# Altium schematic sheet US_EPS_MCU.SchDoc
size A3
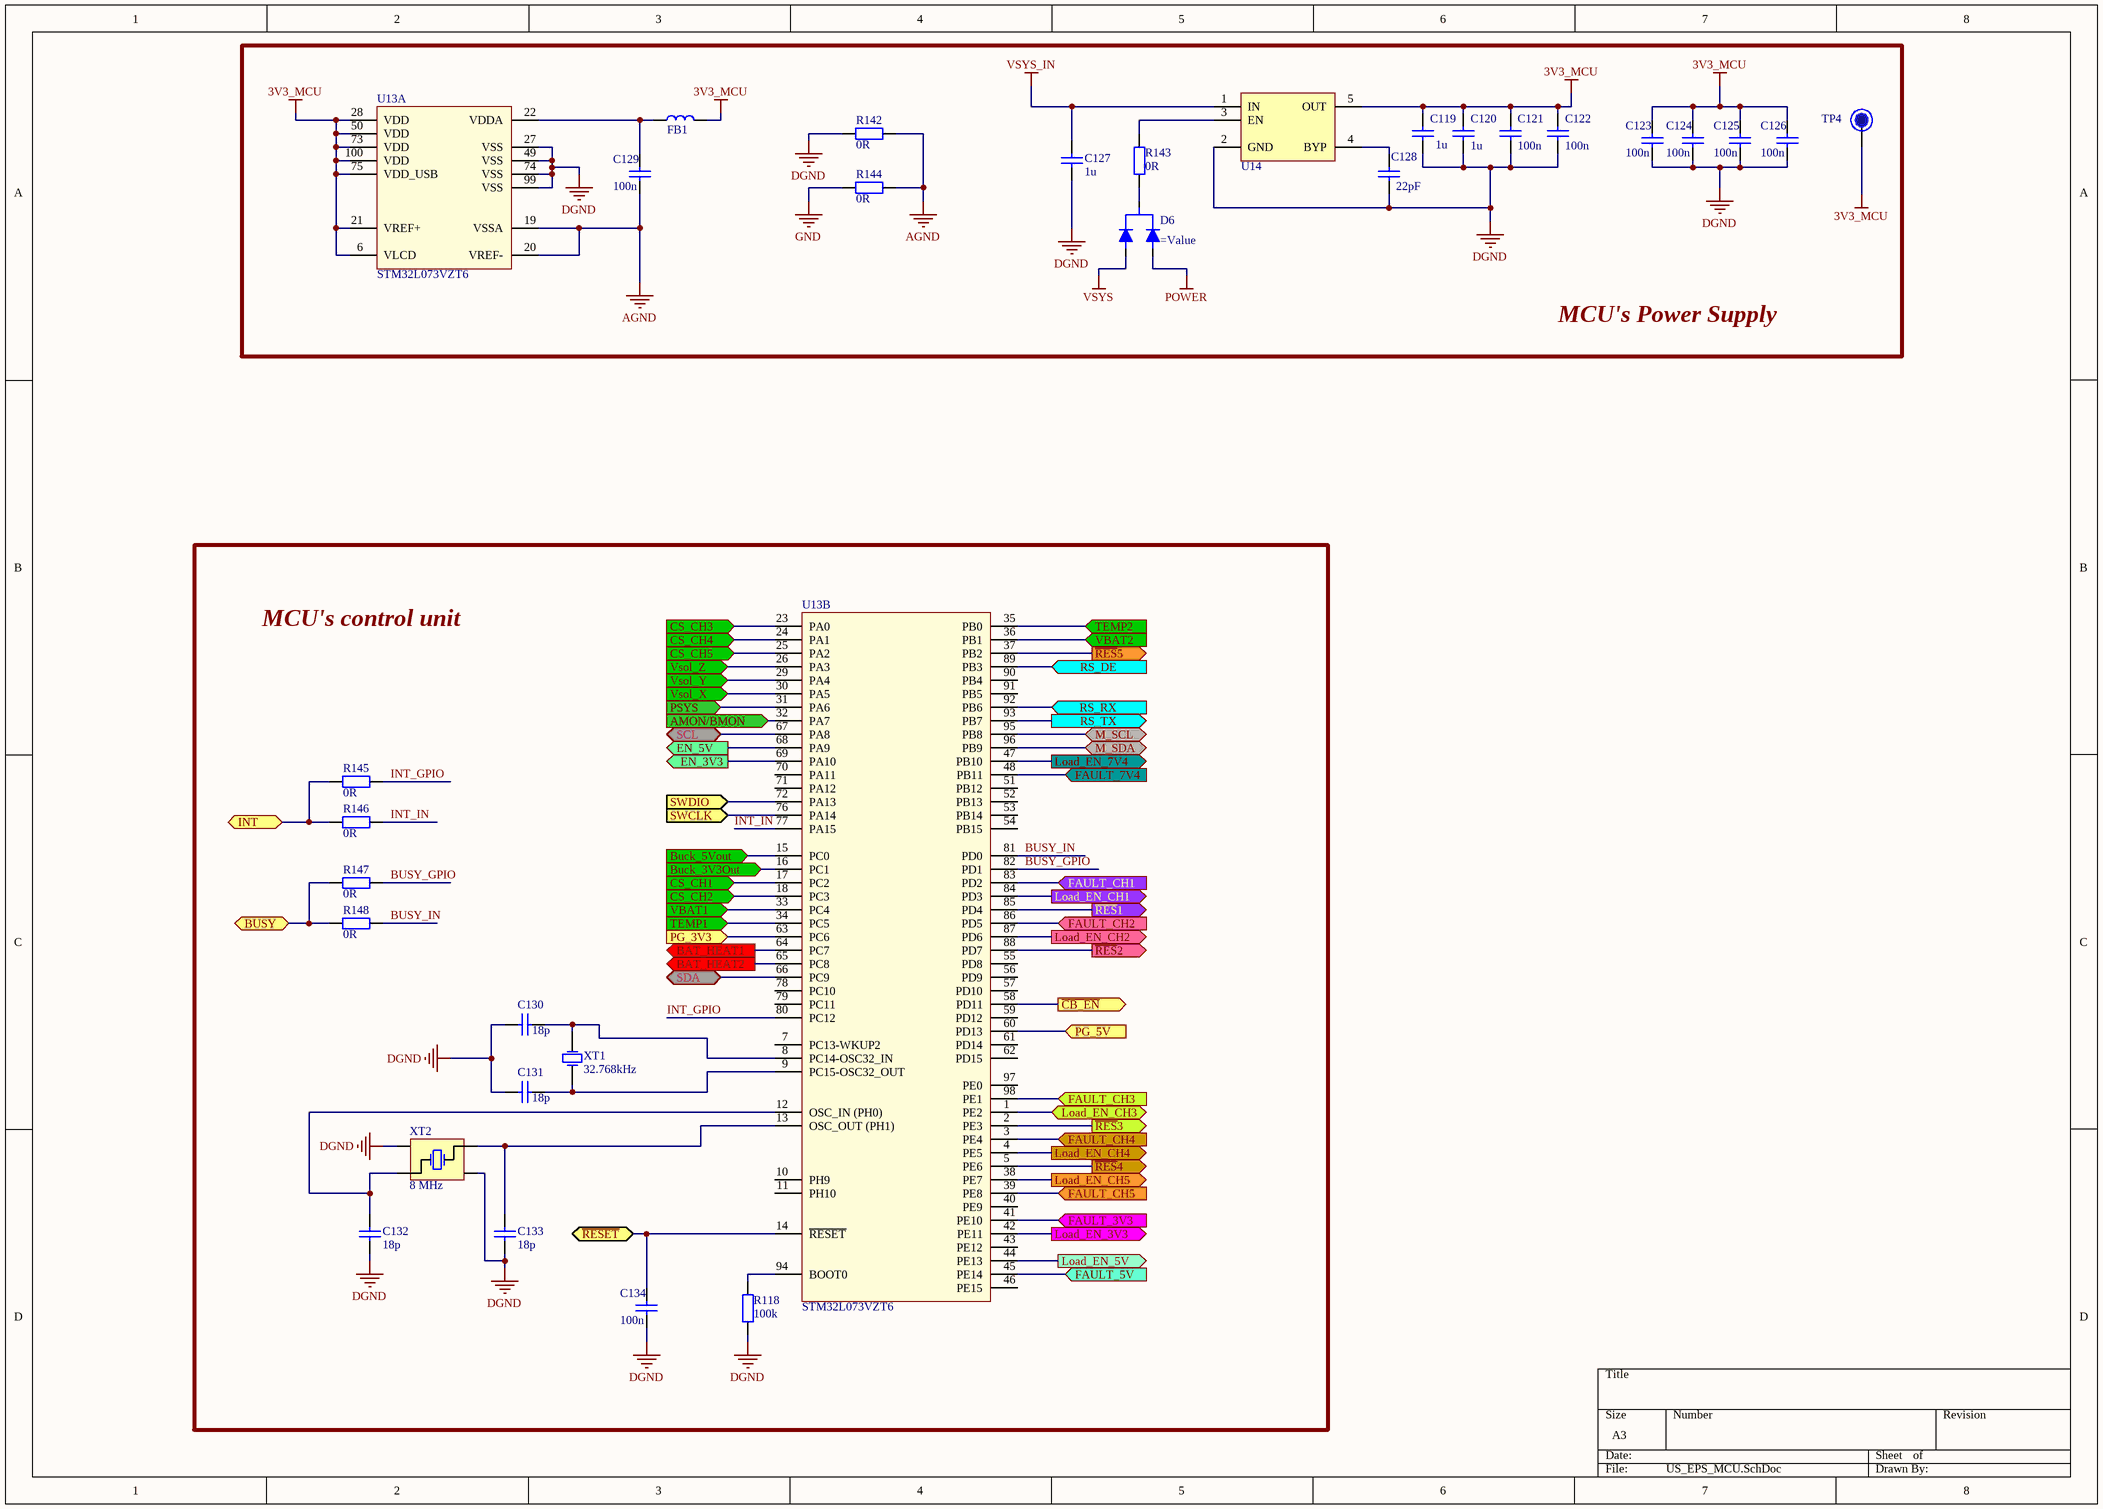
[diagram p0: US_EPS_MCU.SchDoc]

## Parts
C119  1u  [C0603_IPC_HD]
C120  1u  [C0603_IPC_HD]
C121  100n  [C0603_IPC_HD]
C122  100n  [C0603_IPC_HD]
C123  100n  [C0603_IPC_HD]
C124  100n  [C0603_IPC_HD]
C125  100n  [C0603_IPC_HD]
C126  100n  [C0603_IPC_HD]
C127  1u  [C0603_IPC_HD]
C128  22pF  [C0603_IPC_HD]
C129  100n  [C0603_IPC_HD]
C130  18p  [C0603_IPC_HD]
C131  18p  [C0603_IPC_HD]
C132  18p  [C0603_IPC_HD]
C133  18p  [C0603_IPC_HD]
C134  100n  [C0603_IPC_HD]
D6  (no value)  [BAT54C_SOT23]
FB1  MH1608-601Y  [L0603_IPC_MD]  (value not drawn)
R118  100k  [R0603_IPC_MD]
R142  0R  [R0603_IPC_MD]
R143  0R  [R0603_IPC_MD]
R144  0R  [R0603_IPC_MD]
R145  0R  [R0603_IPC_MD]  (no BOM)
R146  0R  [R0603_IPC_MD]  (no BOM)
R147  0R  [R0603_IPC_MD]  (no BOM)
R148  0R  [R0603_IPC_MD]  (no BOM)
TP4  Test Point  [TestPoint_1M5]  (value not drawn)  (no BOM)
U13  STM32L073VZT6  [STM32L073_TSQFP50P1600X1600X160-100N]  (parts A,B of 2)
U14  MIC5216-3.3YM5-TR  [SOT23-5_(MT)]  (value not drawn)
XT1  32.768kHz  [FC-135R]
XT2  8 MHz  [5.0X3.2_4PAD_SMT]

## Blocks framed on the sheet
MCU's Power Supply: C119-C129 D6 FB1 R142-R144 TP4 U13 U14
MCU's control unit: C130-C134 R118 R145-R148 U13 XT1 XT2

## Ports
AMON/BMON (in), BAT_HEAT1 (out), BAT_HEAT2 (out), Buck_3V3Out (in), Buck_5Vout (in), BUSY, CS_CH1 (in), CS_CH2 (in), CS_CH3 (in), CS_CH4 (in), CS_CH5 (in), EN_3V3 (out), EN_5V (out), FAULT_3V3 (in), FAULT_5V (in), FAULT_7V4 (in), FAULT_CH1 (in), FAULT_CH2 (in), FAULT_CH3 (in), FAULT_CH4 (in), FAULT_CH5 (in), INT, Load_EN_3V3 (out), Load_EN_5V (out), Load_EN_7V4 (out), Load_EN_CH1 (out), Load_EN_CH2 (out), Load_EN_CH3, Load_EN_CH4 (out), Load_EN_CH5 (out), M_SCL, M_SDA, PG_3V3 (in), PG_5V (in), PSYS (in), RS_DE (in), RS_RX (in), RS_TX (out), SCL, SDA, SWCLK (in), SWDIO (in), TEMP1 (in), TEMP2 (in), VBAT1 (in), VBAT2 (in), Vsol_X (in), Vsol_Y (in), Vsol_Z (in), ~{CB_EN} (out), ~{RESET}, ~{RES}1 (out), ~{RES}2 (out), ~{RES}3 (out), ~{RES}4 (out), ~{RES}5 (out)

## Nets
3V3_MCU: C119.2 C120.2 C121.2 C122.2 C123.2 C124.2 C125.2 C126.2 FB1.2 TP4.0 U13.6(VLCD) U13.21(VREF+) U13.28(VDD) U13.50(VDD) U13.73(VDD) U13.75(VDD_USB) U13.100(VDD) U14.5(OUT)
AGND: C129.1 R142.1 R144.1 U13.19(VSSA) U13.20(VREF-)
DGND: C119.1 C120.1 C121.1 C122.1 C123.1 C124.1 C125.1 C126.1 C127.1 C128.1 C130.1 C131.1 C132.1 C133.1 C134.1 R118.1 R142.2 U13.27(VSS) U13.49(VSS) U13.74(VSS) U13.99(VSS) U14.2(GND) XT2.2(NC) XT2.4(NC)
GND: R144.2
POWER: D6.2
VSYS: D6.1
VSYS_IN: C127.2 U14.1(IN)
~{CB_EN}: U13.58(PD11) ; port ~{CB_EN}
~{RES}1: U13.85(PD4) ; port ~{RES}1
~{RES}2: U13.88(PD7) ; port ~{RES}2
~{RES}3: U13.2(PE3) ; port ~{RES}3
~{RES}4: U13.5(PE6) ; port ~{RES}4
~{RES}5: U13.37(PB2) ; port ~{RES}5
AMON/BMON: U13.32(PA7) ; port AMON/BMON
BAT_HEAT1: U13.64(PC7) ; port BAT_HEAT1
BAT_HEAT2: U13.65(PC8) ; port BAT_HEAT2
Buck_3V3Out: U13.16(PC1) ; port Buck_3V3Out
Buck_5Vout: U13.15(PC0) ; port Buck_5Vout
BUSY: R147.2 R148.2 ; port BUSY
BUSY_GPIO: R147.1 U13.82(PD1)
BUSY_IN: R148.1 U13.81(PD0)
CS_CH1: U13.17(PC2) ; port CS_CH1
CS_CH2: U13.18(PC3) ; port CS_CH2
CS_CH3: U13.23(PA0) ; port CS_CH3
CS_CH4: U13.24(PA1) ; port CS_CH4
CS_CH5: U13.25(PA2) ; port CS_CH5
EN_3V3: U13.69(PA10) ; port EN_3V3
EN_5V: U13.68(PA9) ; port EN_5V
FAULT_3V3: U13.41(PE10) ; port FAULT_3V3
FAULT_5V: U13.45(PE14) ; port FAULT_5V
FAULT_7V4: U13.48(PB11) ; port FAULT_7V4
FAULT_CH1: U13.83(PD2) ; port FAULT_CH1
FAULT_CH2: U13.86(PD5) ; port FAULT_CH2
FAULT_CH3: U13.98(PE1) ; port FAULT_CH3
FAULT_CH4: U13.3(PE4) ; port FAULT_CH4
FAULT_CH5: U13.39(PE8) ; port FAULT_CH5
INT: R145.2 R146.2 ; port INT
INT_GPIO: R145.1 U13.80(PC12)
INT_IN: R146.1 U13.77(PA15)
Load_EN_3V3: U13.42(PE11) ; port Load_EN_3V3
Load_EN_5V: U13.44(PE13) ; port Load_EN_5V
Load_EN_7V4: U13.47(PB10) ; port Load_EN_7V4
Load_EN_CH1: U13.84(PD3) ; port Load_EN_CH1
Load_EN_CH2: U13.87(PD6) ; port Load_EN_CH2
Load_EN_CH3: U13.1(PE2) ; port Load_EN_CH3
Load_EN_CH4: U13.4(PE5) ; port Load_EN_CH4
Load_EN_CH5: U13.38(PE7) ; port Load_EN_CH5
M_SCL: U13.95(PB8) ; port M_SCL
M_SDA: U13.96(PB9) ; port M_SDA
PG_3V3: U13.63(PC6) ; port PG_3V3
PG_5V: U13.60(PD13) ; port PG_5V
PSYS: U13.31(PA6) ; port PSYS
~{RESET}: C134.2 U13.14(~{RESET}) ; port ~{RESET}
RS_DE: U13.89(PB3) ; port RS_DE
RS_RX: U13.92(PB6) ; port RS_RX
RS_TX: U13.93(PB7) ; port RS_TX
SCL: U13.67(PA8) ; port SCL
SDA: U13.66(PC9) ; port SDA
SWCLK: U13.76(PA14) ; port SWCLK
SWDIO: U13.72(PA13) ; port SWDIO
TEMP1: U13.34(PC5) ; port TEMP1
TEMP2: U13.35(PB0) ; port TEMP2
VBAT1: U13.33(PC4) ; port VBAT1
VBAT2: U13.36(PB1) ; port VBAT2
Vsol_X: U13.30(PA5) ; port Vsol_X
Vsol_Y: U13.29(PA4) ; port Vsol_Y
Vsol_Z: U13.26(PA3) ; port Vsol_Z
NetC128_2: C128.2 U14.4(BYP)
NetC129_2: C129.2 FB1.1 U13.22(VDDA)
NetC130_2: C130.2 U13.8(PC14-OSC32_IN) XT1.2(OSC2)
NetC131_2: C131.2 U13.9(PC15-OSC32_OUT) XT1.1(OSC1)
NetC132_2: C132.2 U13.12(OSC_IN_(PH0)) XT2.3(OSC2)
NetC133_2: C133.2 U13.13(OSC_OUT_(PH1)) XT2.1(OSC1)
NetD6_3: D6.3 R143.1
NetR118_2: R118.2 U13.94(BOOT0)
NetR143_2: R143.2 U14.3(EN)

Not connected (* = marked no-connect by the designer): U13 7(PC13-WKUP2) 10(PH9) 11(PH10) 40(PE9) 43(PE12) 46(PE15) 51(PB12) 52(PB13) 53(PB14) 54(PB15) 55(PD8) 56(PD9) 57(PD10) 59(PD12) 61(PD14) 62(PD15) 70(PA11) 71(PA12) 78(PC10) 79(PC11) 90(PB4) 91(PB5) 97(PE0)

## Library data of the parts
C119 C120 C127 = CL10B105MO8NNWC: CAP CER 1UF 16V X7R 0603; Manufacturer: Samsung Electro-Mechanics; Manufacturer Part Number: CL10B105MO8NNWC; Voltage: 16V; Value: 1u; Dielectric: X7R; Supplier 1: Digi-Key; Supplier Part Number 1: 1276-6524-1-ND
C121-C126 C129 C134 = CL10B104KO8NNNC: CAP CER 0.1UF 16V X7R 0603; Manufacturer: Samsung Electro-Mechanics; Manufacturer Part Number: CL10B104KO8NNNC; Voltage: 16V; Value: 100n; Dielectric: X7R; Supplier 1: Digi-Key; Supplier Part Number 1: 1276-1005-1-ND
C128 = CL0603_22pF_50V: CAP CER 22PF 50V C0G/NP0 0603; Manufacturer: Wurth Electronics Inc.; Manufacturer Part Number: 885012006053; Dielectric: X7R; Voltage: 50V; Value: 22pF; Supplier 1: Digi-Key; Supplier Part Number 1: 732-7795-1-ND
C130-C133 = CL10C180JB8NNNC: CAP CER 18PF 50V C0G/NP0 0603; Manufacturer: Samsung Electro-Mechanics; Manufacturer Part Number: CL10C180JB8NNNC; Voltage: 50V; Value: 18p; Dielectric: C0G/NP0; Supplier 1: Digi-Key; Supplier Part Number 1: 1276-1089-1-ND
D6 = BAT54CQ-7: Diode Schottky 30V 200mA Surface Mount SOT-23(ISL9237); Manufacturer: Diodes Incorporated; Manufacturer Part Number: BAT54CQ-7-F; Reverse Recovery Time (trr): 5ns; Voltage - DC Reverse (Vr) (Max): 30V; Supplier 1: Digi-Key; Supplier Part Number 1: BAT54CQ-7-FDICT-ND; Current - Average Rectified (Io): 200mA
FB1 = MH1608-601Y: FERRITE BEAD 600R@100MHz 0603 for Power Line, 1000mA; Manufacturer: Bourns Inc.; Manufacturer Part Number: MH1608-601Y; Supplier 1: Digi-Key; Supplier Part Number 1: MH1608-601YCT-ND
R118 = CR0603-JW-104ELF: RES 100K OHM 1% 1/10W 0603; Manufacturer: Stackpole Electronics Inc; Manufacturer Part Number: RMCF0603FT100K; Value: 100k; Tolarance: ±1%; Supplier 1: Digi-Key; Supplier Part Number 1: RMCF0603FT100KCT-ND
R142-R148 = CR0603-J/-000ELF: RES SMD 0 OHM JUMPER 1/10W 0603; Manufacturer: Bourns Inc.; Tolarance: 1%; Value: 0R; Manufacturer Part Number: CR0603-J/-000ELF; Supplier 1: Digi-Key; Supplier Part Number 1: CR0603-J/-000ELFCT-ND
TP4 = TP
U13 = STM32L073VZT6_EPS: ARM® Cortex®-M0+ STM32L0 Microcontroller IC 32-Bit 32MHz 192KB (192K x 8) FLASH 100-LQFP (14x14); Manufacturer: STMicroelectronics; SRAM: 20KB; Manufacturer Part Number: STM32L073VZT6; FLASH: 192KB; Supplier 1: Digi-Key; Supplier Part Number 1: 497-17508-ND
U14 = MIC5216-3.3YM5-TR: IC REG LINEAR 3.3V 500MA SOT23-5; Manufacturer: Microchip Technology; Manufacturer Part Number: MIC5216-3.3YM5-TR; Supplier 1: Digi-Key; Supplier Part Number 1: 576-2756-1-ND
XT1 = FC-135-32.7680K: 32.768kHz ±20ppm Crystal 12.5pF 70 kOhms 2-SMD, No Lead; Manufacturer: EPSON; Manufacturer Part Number: FC-135 32.7680KA-A5; Frequency: 32.768kHz; Tolarance: ±20ppm; Supplier 1: Digi-Key; Supplier Part Number 1: SER4103CT-ND
XT2 = ABM3B-8.000MHZ-10-1-U-T: 8MHz ±10ppm Crystal 10pF 200 Ohms 4-SMD, No Lead; Manufacturer: Abracon LLC; Manufacturer Part Number: ABM3B-8.000MHZ-10-1-U-T; Type: XTAL; Value: 8 MHz